# EAGLE design WeMos-RN2483 (EAGLE 7.7.0)
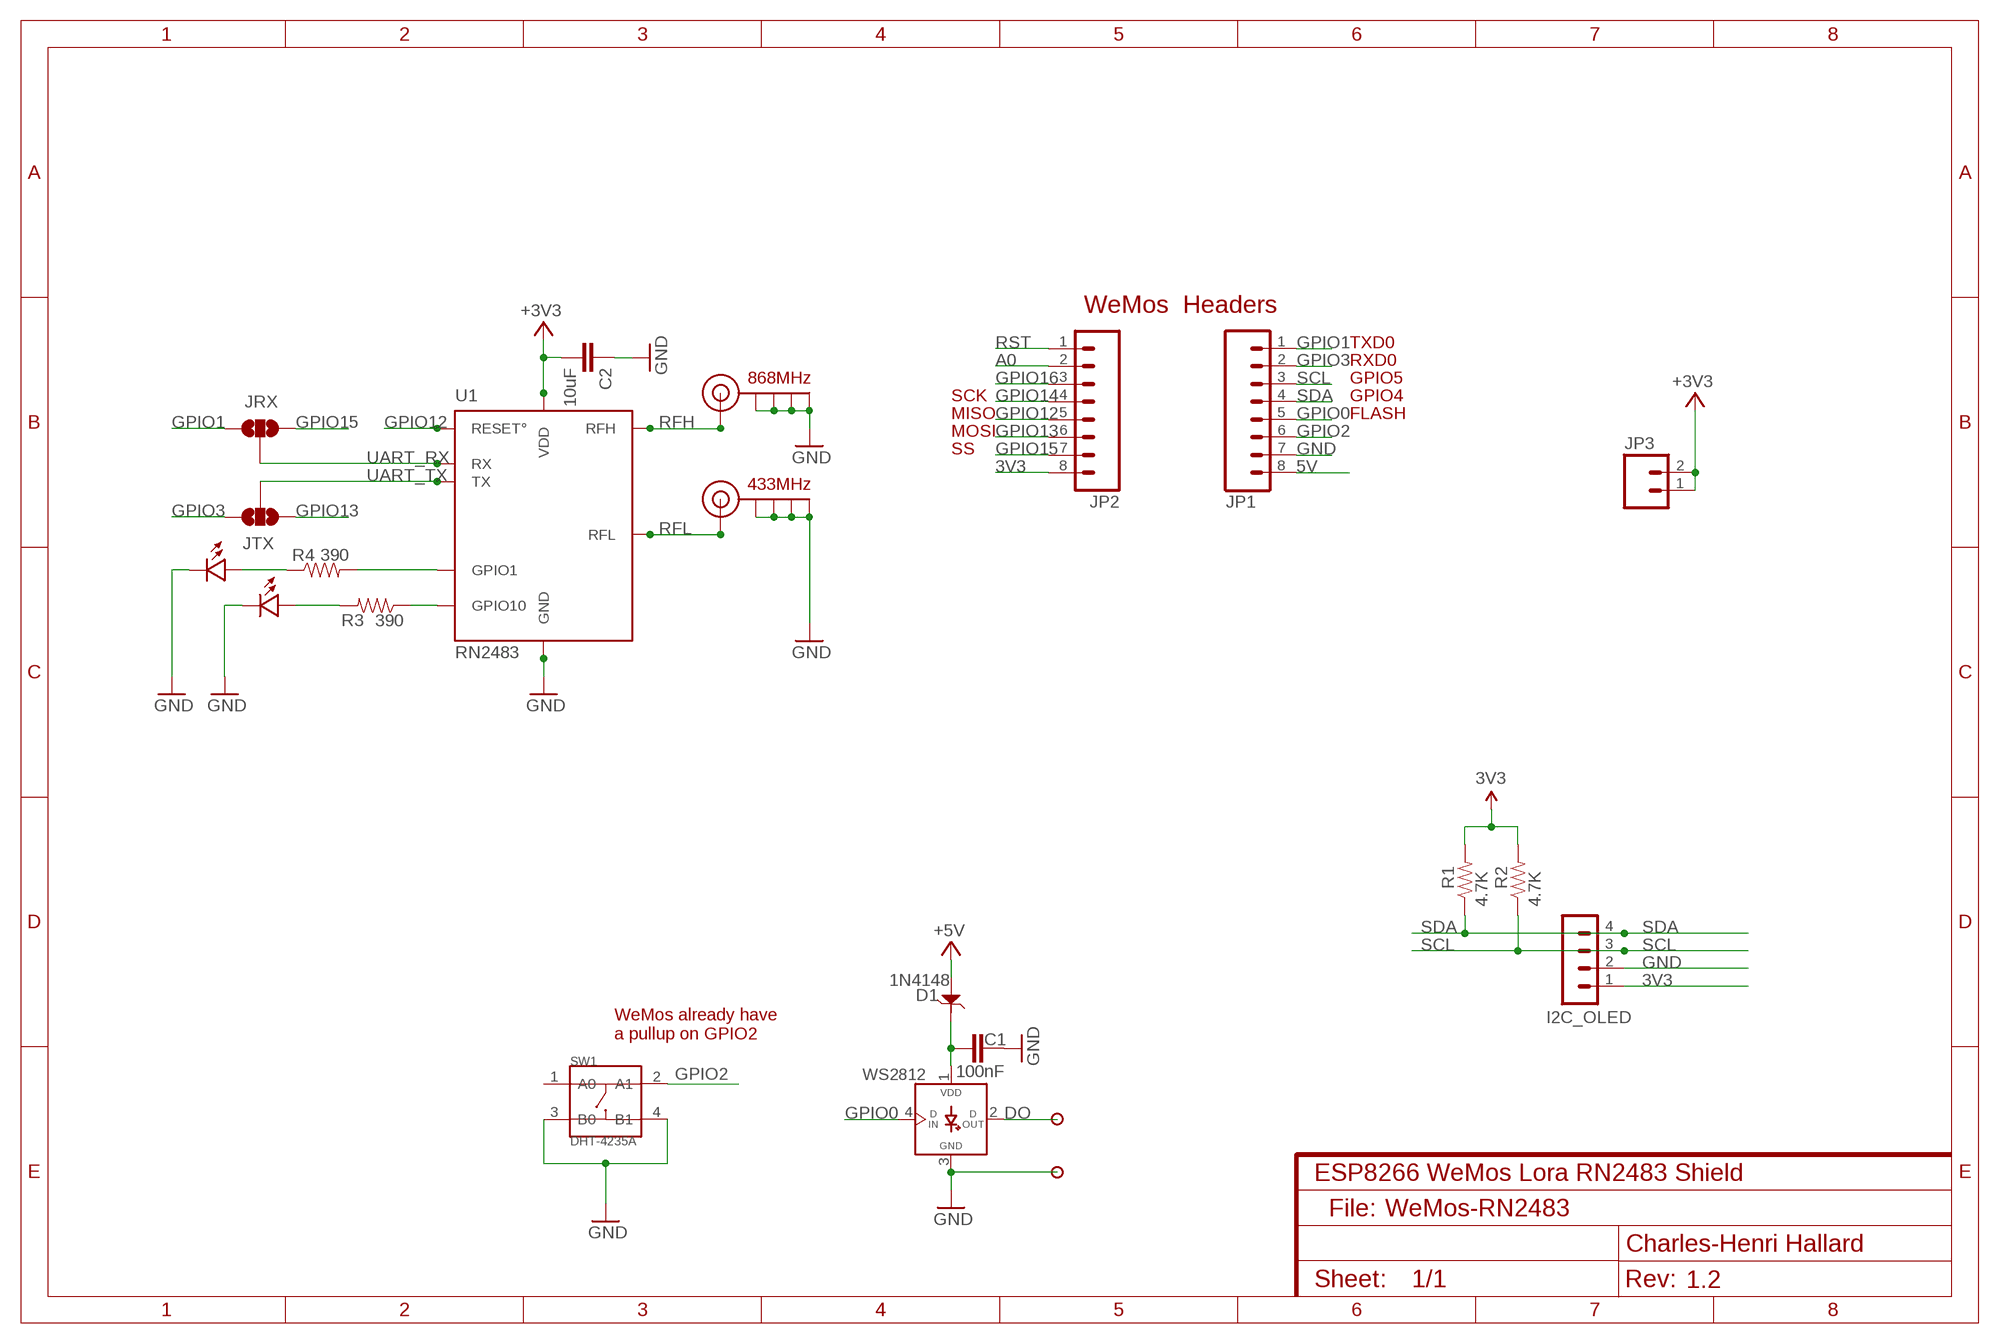
[diagram p0: schematic, sheet 1]
NAME (FRAME-A4L): CNAME: ESP8266 WeMos Lora RN2483 Shield; CREVISION: 1.2; DESIGNER: Charles-Henri Hallard

## Parts
C1  100nF  CAP0805-CAP  [0805-CAP]
C2  10uF  CAP0805-CAP-LARGEPADS  [0805-CAP-LARGEPADS]
D1  1N4148  D-ESD-2P-CESD5V0D1  [SOD123-2.7X1.6]
I2C_OLED  CON_HEADER_1X04'SMALL''  [M1X4]
J$1  ANTENNASMALL  [SMA_UFL_PAD_SMALL]
J$3  ANTENNASMALL  [SMA_UFL_PAD_SMALL]
JP1  M08NO_SILK_FEMALE_PTH  [1X08_NO_SILK]
JP2  M08NO_SILK_FEMALE_PTH  [1X08_NO_SILK]
JP3  M021X02_NO_SILK  [1X02_NO_SILK]
JRX  JUMPER-PAD-3-NOFULL_BOX_SILK  [PAD-JUMPER-3-NO_YES_SILK_FULL_BOX]
JTX  JUMPER-PAD-3-NOFULL_BOX_SILK  [PAD-JUMPER-3-NO_YES_SILK_FULL_BOX]
P2  PADNORMAL  [PAD]
P3  PADNORMAL  [PAD]
R1  4.7K  RESISTOR0805-RES  [0805-RES]
R2  4.7K  RESISTOR0805-RES  [0805-RES]
R3  390  RESISTOR0805-RES  [0805-RES]
R4  390  RESISTOR0805-RES  [0805-RES]
SW1  DHT-4235A  SMD-BUTTON-TOP-DHT-4235A(4P-4.2X3.2MM)  [SW4-SMD-4.2X3.2X2.5MM]
U1  RN2483  RN2483_4GPIO  [RN2483_4GPIO]
U$2  GRN  LED0805  [0805-LED]
U$3  RED  LED0805  [0805-LED]
WS2812  WS2812B  WS2812BSMD  [WS2812B]

## Nets
3V3: C2.2 I2C_OLED.1 JP2.8 JP3.1 JP3.2 R1.2 R2.2 U1.VDD U1.VDD2(VDD) ; supply symbol labelled +3V3
5V: D1.1 JP1.8 ; supply symbol labelled +5V
A0: JP2.2
DO: P2.1 WS2812.2(DOUT)
GND: C1.2 C2.1 I2C_OLED.2 J$1.GND1(GND) J$1.GND2(GND) J$1.GND3(GND) J$1.GND4(GND) J$3.GND1(GND) J$3.GND2(GND) J$3.GND3(GND) J$3.GND4(GND) JP1.7 P3.1 SW1.3(B0) SW1.4(B1) U1.GND U1.GND1(GND) U1.GND2(GND) U1.GND3(GND) U1.GND4(GND) U1.GND5(GND) U1.GND6(GND) U1.GND7(GND) U1.GND8(GND) U1.GND9(GND) U1.GND10(GND) U1.GND11(GND) U1.GND12(GND) U$2.MINUS U$3.MINUS WS2812.3(GND)
GPIO0: JP1.5 WS2812.4(DIN)
GPIO1: JP1.1 JRX.1
GPIO2: JP1.6 SW1.2(A1)
GPIO3: JP1.2 JTX.3
GPIO12: JP2.5 U1.RESET°
GPIO13: JP2.6 JTX.1
GPIO14: JP2.4
GPIO15: JP2.7 JRX.3
GPIO16: JP2.3
N$1: R4.2 U1.GPIO1
N$2: R3.1 U1.GPIO10
N$3: R3.2 U$3.PLUS
N$4: R4.1 U$2.PLUS
RFH: J$3.ANT1(SIGNAL) J$3.ANT2(SIGNAL) U1.RFH
RFL: J$1.ANT1(SIGNAL) J$1.ANT2(SIGNAL) U1.RFL
RST: JP2.1
SCL: I2C_OLED.3 JP1.3 R2.1
SDA: I2C_OLED.4 JP1.4 R1.1
UART_RX: JRX.2 U1.UART_RX(RX)
UART_TX: JTX.2 U1.UART_TX(TX)
VLED: C1.1 D1.2 WS2812.1(VDD)
Unconnected: SW1.1(A0)

## Notes on the sheet
- WeMos  Headers
- TXD0
- RXD0
- 868MHz | GPIO5
- SCK | GPIO4
- MISO | FLASH
- MOSI
- SS
- 433MHz
- WeMos already have
  a pullup on GPIO2
- File:

## Library data of the parts
C1 C2 = _c2h:CAP: Capacitor Standard 0603 ceramic capacitor, and 0.1" leaded capacitor.
D1 = Seeed-Discrete:D-ESD-2P: Diodes for Protectiong against ESD
I2C_OLED = _c2h:CON_HEADER_1X04
J$1 J$3 = _c2h:ANTENNA: SMA Antenna Connector End launch SMA connector. The paste layer has been removed so that the connector can be hand soldered onto the board after reflow.
JP1 JP2 = SparkFun-Connectors:M08: Header 8 Standard 8-pin 0.1" header. Use with straight break away headers (SKU : PRT-00116), right angle break away headers (PRT-00553), swiss pins (PRT-00743), machine pins (PRT-00117), and female headers (PRT-00115).; PROD_ID: CONN-08438
JP3 = SparkFun-Connectors:M02: Standard 2-pin 0.1" header. Use with - straight break away headers ( PRT-00116) - right angle break away headers (PRT-00553) - swiss pins (PRT-00743) - machine pins (PRT-00117) - female headers (PRT-00115) Molex polarized connector foot print use with: PRT-08233 with associated crimp pins and housings. 2.54_SCREWTERM for use with PRT-10571. 3.5mm Screw Terminal footprints for PRT-08084 5mm Screw Terminal footprints for use with PRT-08432
JRX JTX = SparkFun-Passives:JUMPER-PAD-3-NO
P2 P3 = _c2h:PAD
R1-R4 = _c2h:RESISTOR: Resistor Basic schematic elements and footprints for 0603, 1206, and PTH resistors.
SW1 = Switch-2016:SMD-BUTTON-TOP-DHT-4235A(4P-4.2X3.2MM): 311020045; MPN: DHT-4235A
U1 = _c2h:RN2483_4GPIO
U$2 U$3 = _c2h:LED
WS2812 = _c2h:WS2812B

## Net classes
0 default: width 0.203 mm, drill 0.356 mm, clearance 0.152 mm
1 power: width 0.203 mm, clearance 0.152 mm

## Board
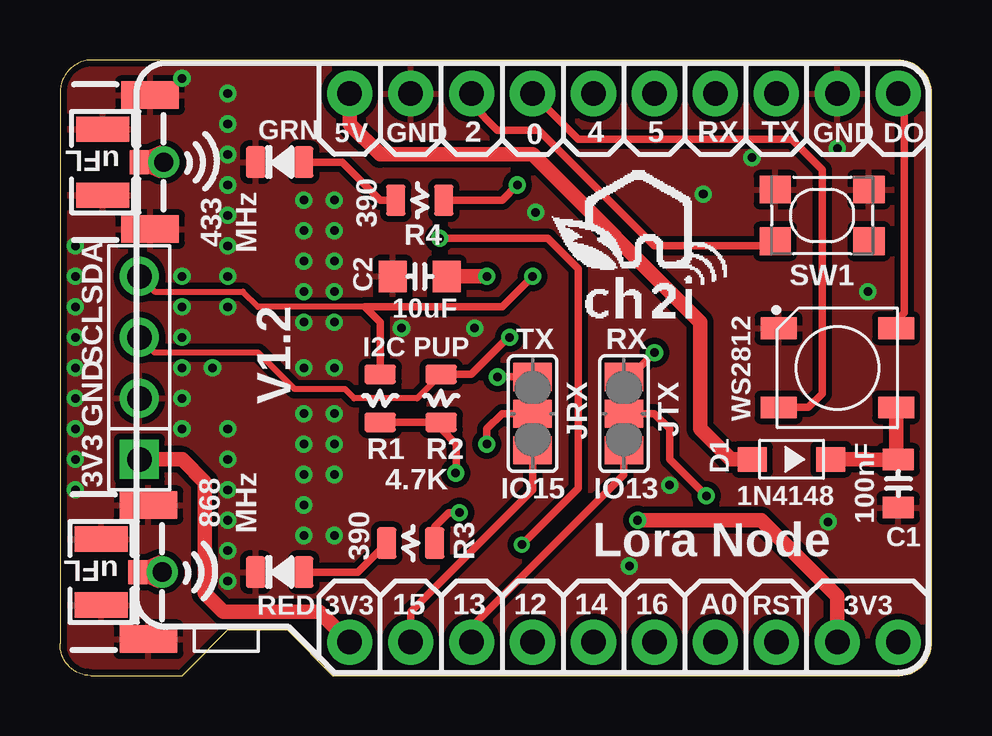
[diagram p1: board, top side]
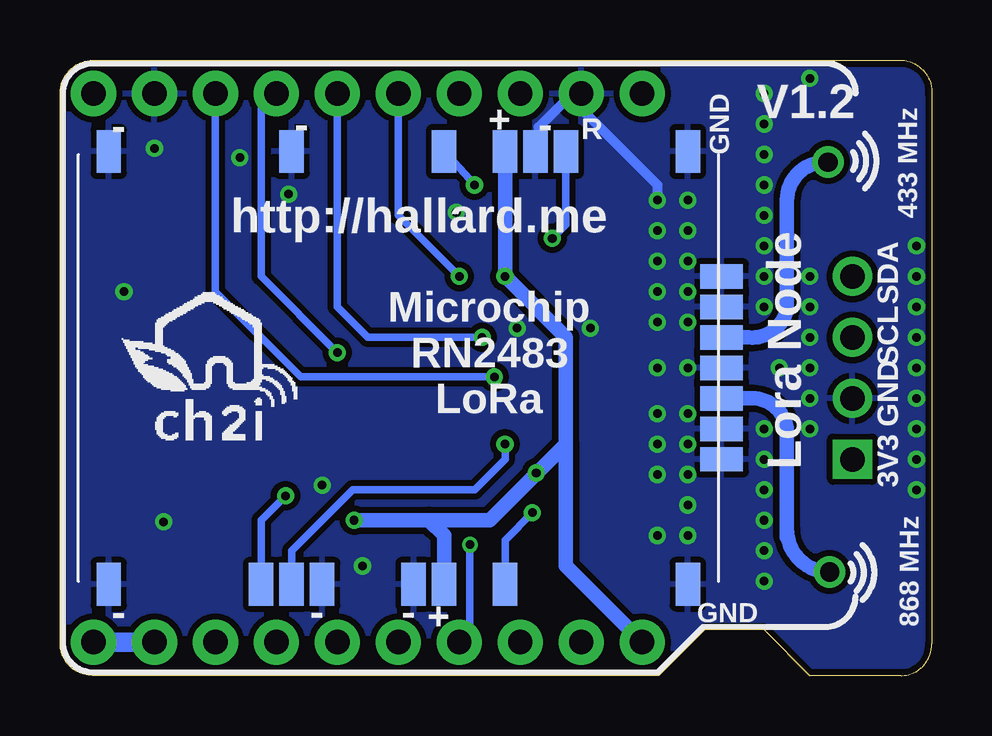
[diagram p2: board, bottom side, seen from below]

Size 36.33 x 25.65 mm. Coordinates in mm from the lower left corner, seen from the top.
Outline: 34.9,25.65 1.24,25.65 arc90 0,24.19 0,1.33 arc90 1.27,0 5.08,0 6.99,1.91 9.47,1.91 11.37,0 34.99,0 arc90 36.33,1.4 36.33,24.26 arc90 34.9,25.65
Copper layers (1*16): Top 0.035mm / dielectric 1.5mm / Bottom 0.035mm
Design rules "ElectroDragon_2layer_DRU_no_angle_20140221": minimum track width 6mil, minimum drill 12mil, track to track 6mil, track to pad 6mil, pad to pad 6mil, via to via 6mil, smd to smd 6mil, copper to edge 8mil, drill to drill 6mil, minimum pad ring 10mil, minimum via ring 6mil, stop-mask expansion 4mil, vias tented up to drill 100mil, thermal gap 10mil

### Footprints (pad centres in the part's own frame; a part is rotated, then mirrored left to right if it is on the bottom)
0805-CAP = smd 0.902 x 1.3: 1 -1,0; 2 1,0
0805-CAP-LARGEPADS = smd 1.156 x 1.3: 1 -1.127,0; 2 1.127,0
SOD123-2.7X1.6 = smd 1.2 x 1.02: 1 -1.635,0; 2 1.635,0
M1X4 = drill 1.02 pad 1.632 square: 1 -3.81,0 | drill 1.02 pad 1.632: 2 -1.27,0; 3 1.27,0; 4 3.81,0
SMA_UFL_PAD_SMALL = smd 0.8 x 1: ANT1 -2.795,0 | drill 0.8: ANT2 -3.81,0 | smd 2.2 x 1.05: GND1 -1.27,1.375; GND2 -1.27,-1.375 | smd 2.413 x 1.143: GND3 -3.239,-2.794; GND4 -3.239,2.794
1X08_NO_SILK = drill 1.016 pad 1.88: 1 0,0; 2 2.54,0; 3 5.08,0; 4 7.62,0; 5 10.16,0; 6 12.7,0; 7 15.24,0; 8 17.78,0
1X02_NO_SILK = drill 1.016 pad 1.88: 1 0,0; 2 2.54,0
PAD-JUMPER-3-NO_YES_SILK_FULL_BOX = smd 1.168 x 1.6: 1 -1.524,0; 2 0,0; 3 1.524,0
PAD = drill 1.016 pad 1.88: 1 0,0
0805-RES = smd 0.8 x 1.3: 1 -1,0; 2 1,0
SW4-SMD-4.2X3.2X2.5MM = smd 1.3 x 1.15: 1 -1.95,1.075; 2 1.95,1.075; 3 -1.95,-1.075; 4 1.95,-1.075
RN2483_4GPIO = smd 1.778 x 1.016: GND 17.907,1.27; GND1 17.907,10.16; GND2 17.907,13.97; GND3 17.907,25.4; GND9 -0.127,25.4; GND10 -0.127,19.05; GND11 -0.127,8.89; GND12 -0.127,1.27; GPIO1 -0.127,15.24; GPIO10 17.907,17.78; RESET° -0.127,20.32; UART_RX 17.907,8.89; UART_TX 17.907,7.62; VDD 17.907,15.24; VDD2 -0.127,17.78 | smd 1.016 x 1.778: GND4 12.7,26.797; GND5 11.43,26.797; GND6 8.89,26.797; GND7 6.35,26.797; GND8 5.08,26.797; RFH 10.16,26.797; RFL 7.62,26.797
0805-LED = smd 0.8 x 1.3: MINUS -1,0; PLUS 1,0
WS2812B = smd 1.5 x 0.9: 1 2.45,-1.65; 2 2.45,1.65; 3 -2.45,1.65; 4 -2.45,-1.65

### Placement (x,y rotation side)
C1  34.93,8 270 top
C2  14.99,16.64 0 top
D1  30.48,9.02 0 top
I2C_OLED  3.31,12.83 90 top
J$1  0.51,21.4 180 top
J$3  0.45,4.32 180 top
JP1  29.85,24.26 180 top
JP2  29.85,1.4 180 top
JP3  32.39,1.4 0 top
JRX  19.69,10.92 270 top
JTX  23.5,10.92 90 top
P2  34.93,24.26 0 top
P3  32.39,24.26 0 top
R1  13.34,11.56 270 top
R2  15.88,11.56 270 top
R3  14.61,5.52 180 top
R4  14.99,19.81 0 top
SW1  31.75,19.18 180 top
U1  35.56,21.72 270 bottom
U$1  [LOGO_CH2I_75MM]  24.58,16.89 0 top
U$2  9.15,21.4 0 top
U$3  9.15,4.32 0 top
U$4  [LOGO_CH2I_75MM]  29.66,11.81 0 bottom
WS2812  32.39,12.83 0 top

### Tracks (layer width: path | path; a pad name or v marks a point on that pad's centre or on a via)
3V3  (via drill 0.36 pad 0.71)
  Top 0.305: R1.2 R2.2 15.88,10.29 16.51,9.65 16.51,8.48 v16.48,8.45
  Top 0.61: JP3.1 32.39,3.3 29.21,6.48 v24.07,6.48 | I2C_OLED.1 5.08,9.02 6.04,8.06 6.04,3.43 6.8,2.67 10.8,2.67 JP2.8 | C2.2 v17.78,16.64
  Bottom 0.305: v16.48,8.45 16.48,8.41 17.15,7.75
  Bottom 0.61: U1.VDD2 v17.78,16.64 15.24,14.1 15.24,9.65 | v24.07,6.48 20.96,6.48 | 20.96,6.48 18.42,6.48 17.15,7.75 15.24,9.65 | U1.VDD 20.32,5.84 20.96,6.48 | 15.24,9.65 15.24,4.57 JP2.8
  Bottom 0.813: JP3.1 JP3.2
5V
  Top 0.61: JP1.8 12.07,22.99 13.34,21.72 19.69,21.72 26.67,14.73 26.67,10.29 27.94,9.02 D1.1
DO
  Top 0.305: WS2812.2 34.84,14.77 35.18,15.11 35.18,24 P2.1
GND  (via drill 0.36 pad 0.71)
  Bottom 0.406: U1.GND10 16.39,21.97 16.39,22.86 14.99,24.26 JP1.7 14.61,23.62 11.43,20.45 v11.43,19.81
  other vias: 6.99,10.29 32.39,21.97 33.66,16 32.01,6.41 6.99,22.99 6.99,24.26 5.08,24.89 6.99,21.72 6.99,20.45 0.64,16.64 0.64,15.37 0.64,14.1 0.64,12.83 0.64,11.56 5.08,16.64 5.08,15.37 5.08,14.1 5.08,11.56 6.99,16.64 6.99,17.91 6.99,19.18 5.08,12.83 5.08,10.29 0.64,10.29 0.64,9.02 6.99,9.02 6.35,12.83 6.99,15.37 6.99,7.75 6.99,6.48 6.99,5.21 6.99,3.94 11.43,17.27 11.43,16 11.43,18.54 10.16,12.83 10.16,10.92 10.16,9.65 10.16,7.11 11.43,14.73 10.16,8.38 10.16,19.81 10.16,18.54 10.16,17.27 10.16,16 10.16,14.73 10.16,5.84 11.43,5.84 11.43,8.38 11.43,9.65 11.43,10.92 11.43,12.83 0.64,17.91 0.64,7.75 28.83,21.59 25.4,7.94 23.72,4.57 26.8,20.07 14.23,14.48 17.28,14.48 19.82,19.3
  pour Bottom (isolate 0.254): 37.47,26.8 37.47,-1.14 -1.27,-1.14 -1.27,26.8
  pour Top (isolate 0.254): -0.63,26.16 36.83,26.16 36.83,-0.51 -0.63,-0.51
GPIO0
  Top 0.305: JP1.5 21.59,22.35 30.48,22.35 31.75,21.08 31.75,11.75 31.18,11.18 WS2812.4
GPIO1  (via drill 0.36 pad 0.71)
  Top 0.305: JRX.1 v18.23,12.45
  Bottom 0.305: v18.23,12.45 26.29,12.45 29.85,16 JP1.1
GPIO2
  Top 0.305: JP1.6 17.15,23.81 18.23,22.73 19.94,22.73 24.77,17.91 29.61,17.91 SW1.2
GPIO3  (via drill 0.36 pad 0.71)
  Top 0.305: JTX.3 23.5,12.19 v24.77,13.46
  Bottom 0.305: v24.77,13.46 27.94,16.64 27.94,23.62 JP1.2
GPIO12  (via drill 0.36 pad 0.61, 0.36 pad 0.71)
  Top 0.305: v15.82,18.22 20.32,18.22 21.59,16.95 21.59,7.81 v19.25,5.46
  Bottom 0.305: U1.RESET° 15.24,18.8 v15.82,18.22 | v19.25,5.46 19.25,1.84 JP2.5
GPIO13
  Top 0.305: JP2.6 17.15,2.03 23.5,8.38 JTX.1
GPIO15
  Top 0.305: JP2.7 14.61,2.67 19.69,7.75 JRX.3
N$1  (via drill 0.36 pad 0.71)
  Top 0.305: R4.2 18.42,19.81 v19.05,20.45
  Bottom 0.305: v19.05,20.45 U1.GPIO1
N$2  (via drill 0.36 pad 0.71)
  Top 0.305: 15.61,5.48 R3.1 15.61,6.21 16.2,6.79 v16.64,6.79
  Bottom 0.305: U1.GPIO10 17.78,5.65 v16.64,6.79
N$3
  Top 0.305: U$3.PLUS 12.4,4.32 R3.2
N$4
  Top 0.305: U$2.PLUS 11.75,21.4 13.34,19.81 R4.1
RFH
  Top 0.61: J$3.ANT2 J$3.ANT1
  Bottom 0.61: U1.RFH 7.62,11.56 arc90 6.04,10.22 6.04,6.1 | 6.04,5.78 6.04,6.1 | J$3.ANT2 arc90 6.04,6.1
RFL
  Top 0.61: J$1.ANT1 J$1.ANT2
  Bottom 0.61: U1.RFL 7.62,14.1 arc-90 6.04,15.37 6.04,19.81 arc90 4.45,21.4 J$1.ANT2
SCL  (via drill 0.36 pad 0.71)
  Top 0.254: I2C_OLED.3 3.94,13.46 8.26,13.46 9.78,11.94 11.88,11.94 12.26,11.56 14.88,11.56 R2.1
  Top 0.305: R2.1 17.13,12.56 18.67,14.1 v18.74,14.1
  Bottom 0.305: v18.74,14.1 23.5,14.1 24.77,15.37 JP1.3
SDA  (via drill 0.36 pad 0.71)
  Top 0.254: I2C_OLED.4 3.94,16 7.62,16 8.26,15.37 12.7,15.37
  Top 0.305: R1.1 13.34,14.73 12.7,15.37 18.42,15.37 v19.69,16.64
  Bottom 0.305: JP1.4 22.23,19.18 v19.69,16.64
UART_RX  (via drill 0.36 pad 0.71)
  Top 0.305: v17.78,9.65 17.78,10.29 18.42,10.92 JRX.2 19.69,9.65
  Bottom 0.305: U1.UART_RX 26.67,5.21 24.13,7.75 19.05,7.75 17.78,9.02 v17.78,9.65
UART_TX  (via drill 0.36 pad 0.71)
  Top 0.305: v26.93,7.49 25.4,9.02 25.4,10.29 24.77,10.92 JTX.2 23.5,9.65
  Bottom 0.305: U1.UART_TX 27.94,6.48 v26.93,7.49
VLED
  Top 0.61: D1.2 33.66,9.02 33.8,9 C1.1 34.84,8.84 WS2812.1

### Text on the board
tNames: 5V | GND | 2 | 0 | 4 | 5 | RX | TX | GND | DO | 433 | MHz | SDA | I2C PUP | SCL | V1.2 | TX | RX | GND | 3V3 | 868 | MHz | IO15 | IO13 | Lora Node | 3V3 | 15 | 13 | 12 | 14 | 16 | A0 | RST | 3V3
bNames: V1.2 | GND | R | - | - | - | + | 433 MHz | http://hallard.me | SDA | Microchip | SCL | Lora Node | LoRa | GND | 3V3 | 868 MHz | GND | - | + | - | -